# EAGLE design geiger PSU (EAGLE 8.4.1)
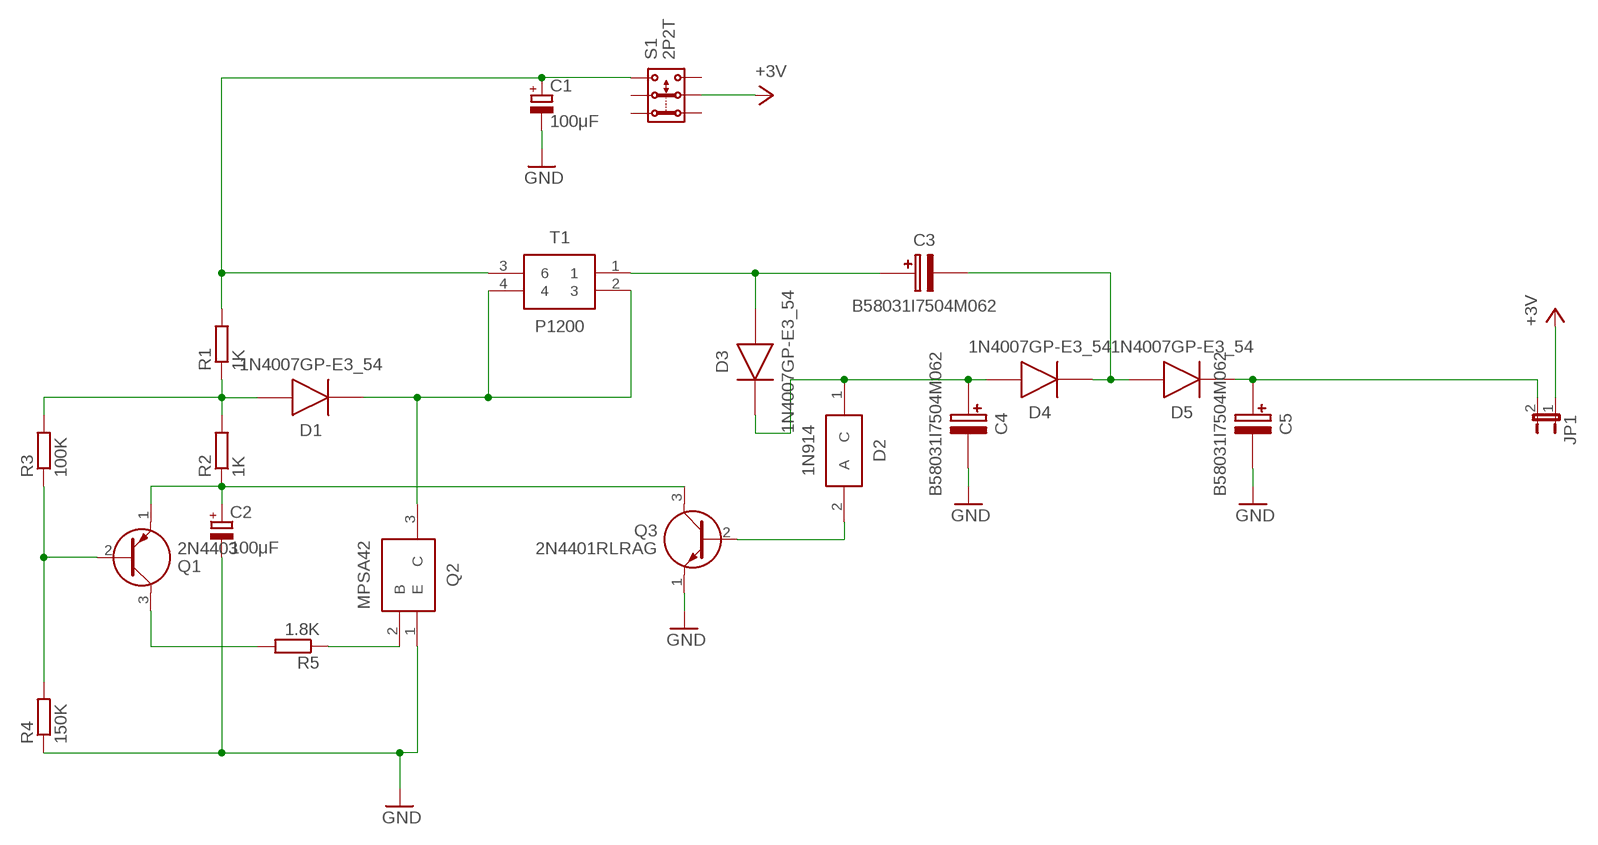
[diagram p0: schematic, sheet 1]

## Parts
C1  100μF  CPOL-EU085CS-1AR  [085CS_1AR]
C2  100μF  CPOL-EU085CS-1AR  [085CS_1AR]
C3  B58031I7504M062  [CAPPC10878X450N]
C4  B58031I7504M062  [CAPPC10878X450N]
C5  B58031I7504M062  [CAPPC10878X450N]
D1  1N4007GP-E3_54  [DIOAD1405W86L465D235]
D2  1N914  [DIO_1N914]
D3  1N4007GP-E3_54  [DIOAD1405W86L465D235]
D4  1N4007GP-E3_54  [DIOAD1405W86L465D235]
D5  1N4007GP-E3_54  [DIOAD1405W86L465D235]
JP1  JP1E  [JP1]
Q1  2N4403  [TO160P419X482X533-3P]
Q2  MPSA42  [TO127P254X635-3]
Q3  2N4401RLRAG  [TO-92]
R1  1K  R-EU_0204/2V  [0204V]
R2  1K  R-EU_0204/2V  [0204V]
R3  100K  R-EU_0204/2V  [0204V]
R4  150K  R-EU_0204/2V  [0204V]
R5  1.8K  R-EU_0204/2V  [0204V]
S1  2P2T  [2P2T]
T1  P1200  [HDRV4W100P762X1270_2X2_1800X18]

## Nets
GND: C1.- C2.- C4.2(-) C5.2(-) Q2.1(E) Q3.1(E) R4.1
N$1: C1.+ R1.2 S1.3.1 T1.3
N$2: D1.2(A) R1.1 R2.2 R3.2
N$3: Q1.2(B) R3.1 R4.2
N$4: C2.+ Q1.1(E) Q3.3(C) R2.1
N$5: Q1.3(C) R5.2
N$6: D1.1(K) Q2.3(C) T1.2 T1.4
N$7: C3.1(+) D3.2(A) T1.1
N$8: Q2.2(B) R5.1
N$9: D2.2(A) Q3.2(B)
N$10: C4.1(+) D2.1(C) D3.1(K) D4.2(A)
N$11: C3.2(-) D4.1(K) D5.2(A)
N$12: C5.1(+) D5.1(K) JP1.2
VCC: JP1.1 S1.2.2 ; supply symbol labelled +3V
Unconnected: S1.1.1 S1.1.2 S1.2.1 S1.3.2

## Library data of the parts
C1 C2 = resistor:CPOL-EU: POLARIZED CAPACITOR, European symbol
C3-C5 = SamacSys_Parts:B58031I7504M062: EPCOS - B58031I7504M062 - CAP, MLCC, AEC-Q200, 0.5UF, 700V, SMD <https://componentsearchengine.com/Images/1/B58031I7504M062.jpg> Source: Datasheet <https://componentsearchengine.com/Datasheets/2/B58031I7504M062.pdf>; DESCRIPTION: EPCOS - B58031I7504M062 - CAP, MLCC, AEC-Q200, 0.5UF, 700V, SMD; HEIGHT: 4.5mm; MANUFACTURER_NAME: EPCOS; MANUFACTURER_PART_NUMBER: B58031I7504M062; SUPPLIER_NAME: RS
D1 D3-D5 = SamacSys_Parts:1N4007GP-E3_54: Vishay 1N4007GP-E3/54, Switching Diode, 1000V 1A, 2000ns, 2-Pin DO-204AL <https://componentsearchengine.com/Images/3/1N4007GP-E3_54.jpg> Source: Datasheet <https://componentsearchengine.com/Datasheets/2/1N4007GP-E3_54.pdf>; DESCRIPTION: Vishay 1N4007GP-E3/54, Switching Diode, 1000V 1A, 2000ns, 2-Pin DO-204AL; HEIGHT: mm; MANUFACTURER_NAME: Vishay; MANUFACTURER_PART_NUMBER: 1N4007GP-E3/54; RS_PART_NUMBER: 7087984P; SUPPLIER_NAME: RS
D2 = SamacSys_Parts:1N914: Small Signal Diode <https://componentsearchengine.com/Images/1/1N914.jpg> Source: Datasheet <http://componentsearchengine.com/Datasheets/1/1N914.pdf>; DESCRIPTION: Small Signal Diode; HEIGHT: mm; MANUFACTURER_NAME: Fairchild Semiconductor; MANUFACTURER_PART_NUMBER: 1N914; SUPPLIER_NAME: RS
JP1 = jumper:JP1E: JUMPER
Q1 = SamacSys_Parts:2N4403: MULTICOMP - 2N4403 - TRANSISTOR, PNP, -40V, -0.6A, TO-92 Source: Datasheet <https://componentsearchengine.com/Datasheets/2/2N4403.pdf>; DESCRIPTION: MULTICOMP - 2N4403 - TRANSISTOR, PNP, -40V, -0.6A, TO-92; HEIGHT: 4.19mm; MANUFACTURER_NAME: MULTICOMP; MANUFACTURER_PART_NUMBER: 2N4403; SUPPLIER_NAME: RS
Q2 = SamacSys_Parts:MPSA42: Transistor <https://componentsearchengine.com/Images/1/MPSA42.jpg> Source: Datasheet <http://componentsearchengine.com/Datasheets/1/MPSA42.pdf>; DESCRIPTION: Transistor; HEIGHT: mm; MANUFACTURER_NAME: Fairchild Semiconductor; MANUFACTURER_PART_NUMBER: MPSA42; RS_PART_NUMBER: 1241357; SUPPLIER_NAME: RS
Q3 = SamacSys_Parts:2N4401RLRAG: Transistor NPN 40V 600mA TO92 ON Semi 2N4401RLRAG NPN Bipolar Transistor, 600 mA 40 V, 3-Pin TO-92 <https://componentsearchengine.com/Images/3/2N4401RLRAG.jpg> Source: Datasheet <http://www.onsemi.com/pub/Collateral/2N4401-D.PDF>; ALLIED_NUMBER: 70100181; DESCRIPTION: Transistor NPN 40V 600mA TO92 ON Semi 2N4401RLRAG NPN Bipolar Transistor, 600 mA 40 V, 3-Pin TO-92; HEIGHT: mm; MANUFACTURER_NAME: ON Semiconductor; MANUFACTURER_PART_NUMBER: 2N4401RLRAG; RS_PART_NUMBER: 7925476; SUPPLIER_NAME: RS
R1-R5 = resistor:R-EU_: RESISTOR, European symbol
S1 = switch:2P2T: SLIDE SWITCH 2P2T Part No. SS-22F05-G(A)4 Source: CANAL ELECTRONIC CO., LTD .. switsch.pdf
T1 = SamacSys_Parts:P1200: ETAL - P1200 - TRANSFORMER, LINE MATCHING, V.32 BIS Source: Datasheet <https://componentsearchengine.com/Datasheets/2/P1200.pdf>; DESCRIPTION: ETAL - P1200 - TRANSFORMER, LINE MATCHING, V.32 BIS; HEIGHT: 12.6mm; MANUFACTURER_NAME: ETAL; MANUFACTURER_PART_NUMBER: P1200; SUPPLIER_NAME: RS

## Board
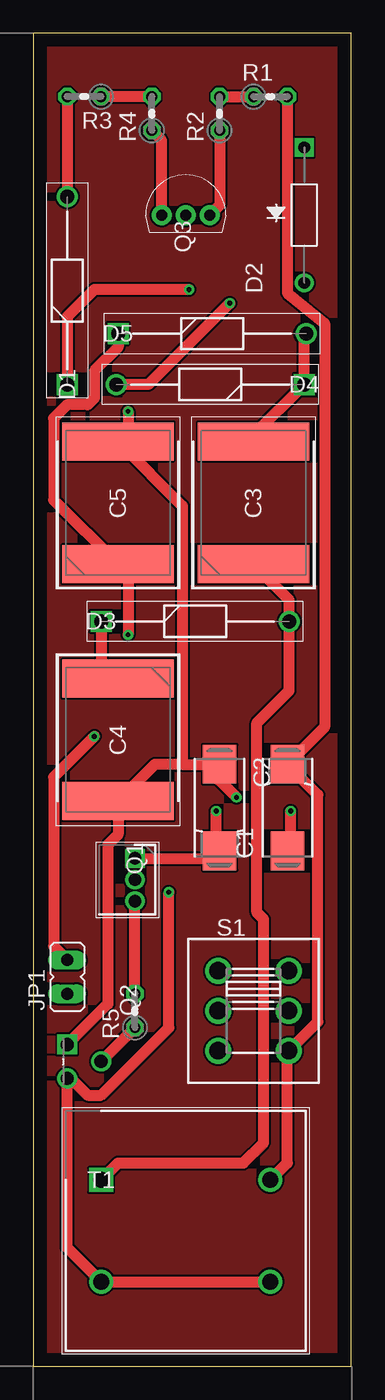
[diagram p1: board, top side]
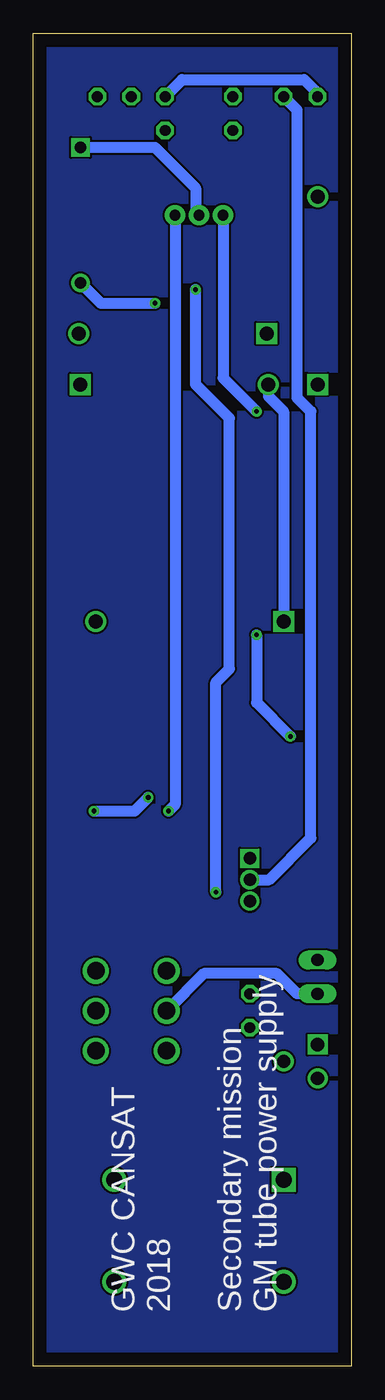
[diagram p2: board, bottom side, seen from below]

Size 23.86 x 100 mm. Coordinates in mm from the lower left corner, seen from the top.
Outline: 0,0 23.86,0 23.86,100 0,100 0,0
Copper layers (1*16): Top 0.035mm / dielectric 1.5mm / Bottom 0.035mm
Design rules "default": minimum track width 6mil, minimum drill 0.35mm, track to track 6mil, track to pad 6mil, pad to pad 6mil, via to via 6mil, smd to smd 6mil, copper to edge 40mil, drill to drill 6mil, minimum pad ring 10mil, minimum via ring 8mil, stop-mask expansion 4mil, vias tented up to drill 0mil, thermal gap 10mil

### Footprints (pad centres in the part's own frame; a part is rotated, then mirrored left to right if it is on the bottom)
085CS_1AR = smd 2.9 x 2.5: + 3.25,0; - -3.25,0
CAPPC10878X450N = smd 2.85 x 8.35: 1 -4.6,0; 2 4.6,0
DIOAD1405W86L465D235 = drill 1.05 pad 1.575 square: 1 0,0 | drill 1.05 pad 1.575: 2 14.1,0
DIO_1N914 = drill 0.889 pad 1.333: 1 -10.16,0 | drill 0.889 pad 1.333 square: 2 0,0
JP1 = drill 0.914 long: 1 0,-1.27; 2 0,1.27
TO160P419X482X533-3P = drill 0.94 pad 1.41 square: 1 0,0 | drill 0.94 pad 1.41: 2 1.6,0; 3 3.2,0
TO127P254X635-3 = drill 0.991 pad 1.486 square: 1 -2.54,-2.54 | drill 0.991 pad 1.486: 2 -1.27,0; 3 0,-2.54
TO-92 = drill 0.81 pad 1.51: 1 0,-1.8; 2 0,0; 3 0,1.8
0204V = drill 0.813 octagon: 1 -1.27,0; 2 1.27,0
2P2T = drill 1.3 pad 1.93: 1.1 -3,2.65; 1.2 -3,-2.65; 2.1 0,2.65; 2.2 0,-2.65; 3.1 3,2.65; 3.2 3,-2.65
HDRV4W100P762X1270_2X2_1800X18 = drill 1.2 pad 1.8 square: 1 0,0 | drill 1.2 pad 1.8: 2 0,-7.62; 3 12.7,0; 4 12.7,-7.62

### Placement (x,y rotation side)
C1  19.05,41.91 90 top
C2  13.97,41.91 270 top
C3  16.51,64.77 90 top
C4  6.35,46.99 270 top
C5  6.35,64.77 90 top
D1  2.54,73.66 90 top
D2  20.32,91.44 90 top
D3  5.08,55.88 0 top
D4  20.32,73.66 180 top
D5  6.35,77.47 0 top
JP1  2.54,29.21 0 top
Q1  7.62,38.1 270 top
Q2  5.08,21.59 270 top
Q3  11.43,86.36 270 top
R1  17.78,95.25 0 top
R2  13.97,93.98 90 top
R3  3.81,95.25 180 top
R4  8.89,93.98 90 top
R5  7.62,26.67 90 top
S1  16.51,26.67 270 top
T1  5.08,13.97 0 top

### Tracks (layer width: path | path; a pad name or v marks a point on that pad's centre or on a via)
GND  (via drill 0.35)
  Top 0.813: Q3.1 9.63,91.97 R4.1 | 11.18,45.16 C2.- 13.97,43.94 v15.24,42.67 | 11.18,45.16 9.12,45.16 C4.2 6.35,39.88 5.59,39.12 5.59,27.18 Q2.1 | C1.- 19.3,38.91 v19.3,41.66 | v7.11,71.63 7.11,70.13 C5.2 11.18,64.54 11.18,45.16
  Bottom 0.813: v19.3,41.66 16.26,41.66 v15.24,42.67 | Q3.1 9.63,74.15 v7.11,71.63
N$1
  Top 0.813: T1.3 19.05,15.24 19.05,23.56 S1.3.1 21.34,25.85 21.34,42.87 C1.+ 21.84,47.95 21.84,78.23 19.05,80.52 R1.2
N$2
  Top 0.813: R2.2 R1.1 | R3.2 D1.2
  Bottom 0.813: R2.2 12.7,96.52 3.56,96.52 2.54,95.5 R3.2
N$3
  Top 0.813: R4.2 R3.1
  Bottom 0.813: Q1.2 6.17,36.5 3.05,39.62 3.05,71.63 4.06,72.64 4.06,94.23 R3.1
N$4  (via drill 0.35)
  Top 0.813: R2.1 13.97,87.1 Q3.3 | 13.72,38.91 v13.72,41.66 | 13.72,38.91 C2.+ | Q1.1 12.9,38.1 13.72,38.91
  Bottom 0.813: Q3.3 13.23,42.14 v13.72,41.66
N$5
  Top 0.813: R5.2 Q1.3
N$6  (via drill 0.35)
  Top 0.813: T1.4 T1.2 2.54,8.89 Q2.3 2.79,21.59 4.06,20.32 5.08,20.32 10.16,25.4 v10.16,35.56 | v11.68,80.77 4.57,80.77 2.54,78.74 D1.1
  Bottom 0.813: v10.16,35.56 10.16,51.31 9.14,52.32 9.14,71.12 11.68,73.66 v11.68,80.77
N$7
  Top 0.813: C3.1 19.18,57.5 D3.2 19.18,50.68 16.76,48.26 16.76,34.04 17.27,33.53 17.27,16.76 15.75,15.24 6.35,15.24 T1.1
N$8
  Top 0.813: Q2.2 R5.1
N$9
  Bottom 0.813: D2.2 14.73,91.44 11.68,88.39 11.68,86.61 Q3.2
N$10  (via drill 0.35)
  Top 0.813: v14.73,79.76 8.64,73.66 D4.2 | D3.1 5.08,52.86 C4.1
  Bottom 0.813: D2.1 18.8,79.76 v14.73,79.76 | D4.2 6.22,72.77 5.08,71.63 D3.1
N$11
  Top 0.813: C3.2 16.51,69.85 D4.1 20.32,77.34 D5.2
N$12  (via drill 0.35)
  Top 0.813: D5.1 6.35,76.45 4.57,74.68 4.57,72.64 4.06,72.14 2.54,72.14 1.52,71.12 1.52,65 C5.1 7.11,59.41 v7.11,54.86 | v4.57,47.24 1.52,44.2 1.52,31.5 JP1.2
  Bottom 0.813: v7.11,54.86 7.11,49.78 v4.57,47.24
N$13
  pour Bottom: 0,0 23.88,0 23.88,100.08 0,100.08
N$14
  pour Top: 0,0 23.88,0 23.88,100.08 0,100.08
VCC
  Bottom 0.813: JP1.1 4.06,27.94 5.59,29.46 11.07,29.46 S1.2.2

### Text on the board
bPlace: GWC CANSAT / 2018 / / Secondary mission / GM tube power supply